# Altium schematic sheet Digit_2.SchDoc
size A3; DocumentNumber: 2; SheetNumber: 2; SheetTotal: 7
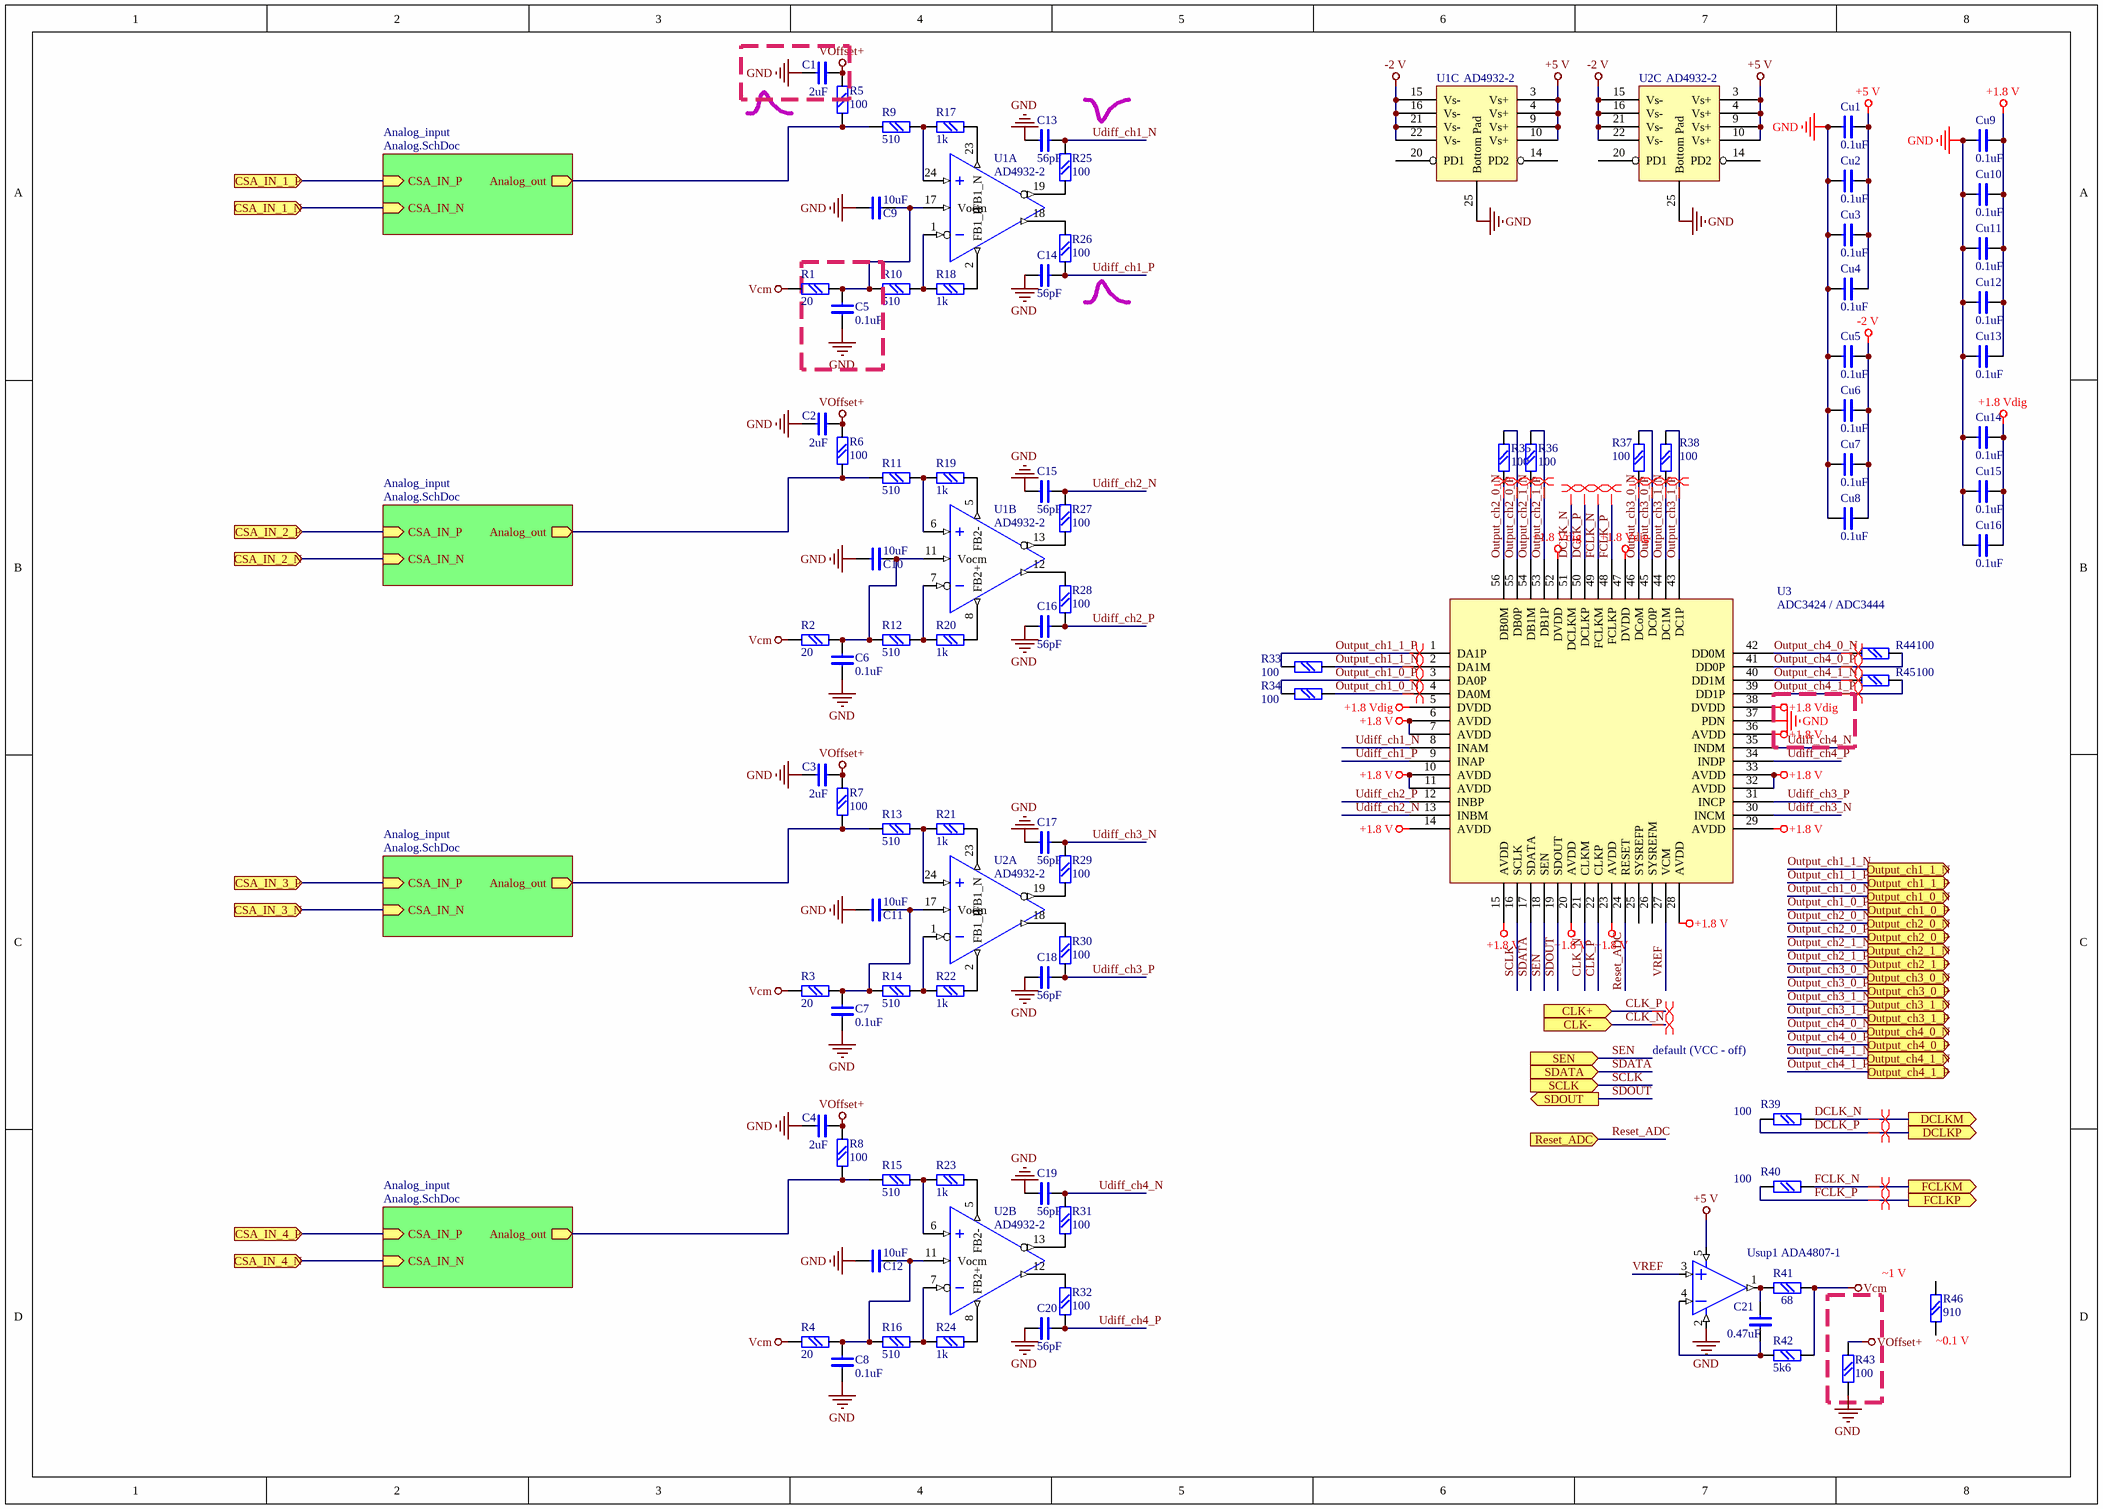
[diagram p0: Digit_2.SchDoc]

## Parts
C1  2uF  [chip0603]
C2  2uF  [chip0603]
C3  2uF  [chip0603]
C4  2uF  [chip0603]
C5  0.1uF  [chip0603]
C6  0.1uF  [chip0603]
C7  0.1uF  [chip0603]
C8  0.1uF  [chip0603]
C9  10uF  [chip0603]
C10  10uF  [chip0603]
C11  10uF  [chip0603]
C12  10uF  [chip0603]
C13  56pF  [chip0603]
C14  56pF  [chip0603]
C15  56pF  [chip0603]
C16  56pF  [chip0603]
C17  56pF  [chip0603]
C18  56pF  [chip0603]
C19  56pF  [chip0603]
C20  56pF  [chip0603]
C21  0.47uF  [chip0603]
Cu1  0.1uF  [chip0603]
Cu2  0.1uF  [chip0603]
Cu3  0.1uF  [chip0603]
Cu4  0.1uF  [chip0603]
Cu5  0.1uF  [chip0603]
Cu6  0.1uF  [chip0603]
Cu7  0.1uF  [chip0603]
Cu8  0.1uF  [chip0603]
Cu9  0.1uF  [chip0603]
Cu10  0.1uF  [chip0603]
Cu11  0.1uF  [chip0603]
Cu12  0.1uF  [chip0603]
Cu13  0.1uF  [chip0603]
Cu14  0.1uF  [chip0603]
Cu15  0.1uF  [chip0603]
Cu16  0.1uF  [chip0603]
R1  20  [chip0603]
R2  20  [chip0603]
R3  20  [chip0603]
R4  20  [chip0603]
R5  100  [chip0603]
R6  100  [chip0603]
R7  100  [chip0603]
R8  100  [chip0603]
R9  510  [chip0603]
R10  510  [chip0603]
R11  510  [chip0603]
R12  510  [chip0603]
R13  510  [chip0603]
R14  510  [chip0603]
R15  510  [chip0603]
R16  510  [chip0603]
R17  1k  [chip0603]
R18  1k  [chip0603]
R19  1k  [chip0603]
R20  1k  [chip0603]
R21  1k  [chip0603]
R22  1k  [chip0603]
R23  1k  [chip0603]
R24  1k  [chip0603]
R25  100  [chip0603]
R26  100  [chip0603]
R27  100  [chip0603]
R28  100  [chip0603]
R29  100  [chip0603]
R30  100  [chip0603]
R31  100  [chip0603]
R32  100  [chip0603]
R33  100  [0402]
R34  100  [0402]
R35  100  [0402]
R36  100  [0402]
R37  100  [0402]
R38  100  [0402]
R39  100  [0402]
R40  100  [0402]
R41  68  [chip0603]
R42  5k6  [chip0603]
R43  100  [chip0603]
R44  100  [0402]
R45  100  [0402]
R46  910  [chip0603]
U1  AD4932-2  [CP-24-13]  (parts A,B,C of 3)
U2  AD4932-2  [CP-24-13]  (parts A,B,C of 3)
U3  ADC3424 / ADC3444  [PQFN-56]
Usup1  ADA4807-1  [SOT23-5]

## Blocks framed on the sheet
~1 V: R43

## Sub-sheets
Analog_input = Analog.SchDoc: CSA_IN_P (in), CSA_IN_N (in), Analog_out (out)
Analog_input = Analog.SchDoc: CSA_IN_P (in), CSA_IN_N (in), Analog_out (out)
Analog_input = Analog.SchDoc: CSA_IN_P (in), CSA_IN_N (in), Analog_out (out)
Analog_input = Analog.SchDoc: CSA_IN_P (in), CSA_IN_N (in), Analog_out (out)

## Ports
CLK+ (in), CLK- (in), CSA_IN_1_N (in), CSA_IN_1_P (in), CSA_IN_2_N (in), CSA_IN_2_P (in), CSA_IN_3_N (in), CSA_IN_3_P (in), CSA_IN_4_N (in), CSA_IN_4_P (in), DCLKM (out), DCLKP (out), FCLKM (out), FCLKP (out), Output_ch1_0_N (out), Output_ch1_0_P (out), Output_ch1_1_N (out), Output_ch1_1_P (out), Output_ch2_0_N (out), Output_ch2_0_P (out), Output_ch2_1_N (out), Output_ch2_1_P (out), Output_ch3_0_N (out), Output_ch3_0_P (out), Output_ch3_1_N (out), Output_ch3_1_P (out), Output_ch4_0_N (out), Output_ch4_0_P (out), Output_ch4_1_N (out), Output_ch4_1_P (out), Reset_ADC (in), SCLK (in), SDATA (in), SDOUT (out), SEN (in)

## Nets
+1.8 V: Cu9.2 Cu10.2 Cu11.2 Cu12.2 Cu13.2 U3.6(AVDD) U3.7(AVDD) U3.10(AVDD) U3.11(AVDD) U3.14(AVDD) U3.15(AVDD) U3.20(AVDD) U3.23(AVDD) U3.28(AVDD) U3.29(AVDD) U3.32(AVDD) U3.33(AVDD) U3.36(AVDD)
+1.8 Vdig: Cu14.2 Cu15.2 Cu16.2 U3.5(DVDD) U3.38(DVDD) U3.47(DVDD) U3.52(DVDD)
+5 V: Cu1.2 Cu2.2 Cu3.2 Cu4.2 U1.3(Vs+) U1.4(Vs+) U1.9(Vs+) U1.10(Vs+) U2.3(Vs+) U2.4(Vs+) U2.9(Vs+) U2.10(Vs+) Usup1.5(E+)
-2 V: Cu5.2 Cu6.2 Cu7.2 Cu8.2 U1.15(Vs-) U1.16(Vs-) U1.21(Vs-) U1.22(Vs-) U2.15(Vs-) U2.16(Vs-) U2.21(Vs-) U2.22(Vs-)
GND: C1.1 C2.1 C3.1 C4.1 C5.1 C6.1 C7.1 C8.1 C9.1 C10.1 C11.1 C12.1 C13.2 C14.1 C15.2 C16.1 C17.2 C18.1 C19.2 C20.1 Cu1.1 Cu2.1 Cu3.1 Cu4.1 Cu5.1 Cu6.1 Cu7.1 Cu8.1 Cu9.1 Cu10.1 Cu11.1 Cu12.1 Cu13.1 Cu14.1 Cu15.1 Cu16.1 R43.2 U1.25(Bottom_Pad) U2.25(Bottom_Pad) U3.37(PDN) Usup1.2(E-)
Vcm: R1.2 R2.2 R3.2 R4.2 R41.2 R42.2
VOffset+: C1.2 C2.2 C3.2 C4.2 R5.2 R6.2 R7.2 R8.2 R43.1
CLK_N: U3.21(CLKM) ; port CLK-
CLK_P: U3.22(CLKP) ; port CLK+
CSA_IN_1_N: port CSA_IN_1_N, sheet Analog_input/CSA_IN_N
CSA_IN_1_P: port CSA_IN_1_P, sheet Analog_input/CSA_IN_P
CSA_IN_2_N: port CSA_IN_2_N, sheet Analog_input/CSA_IN_N
CSA_IN_2_P: port CSA_IN_2_P, sheet Analog_input/CSA_IN_P
CSA_IN_3_N: port CSA_IN_3_N, sheet Analog_input/CSA_IN_N
CSA_IN_3_P: port CSA_IN_3_P, sheet Analog_input/CSA_IN_P
CSA_IN_4_N: port CSA_IN_4_N, sheet Analog_input/CSA_IN_N
CSA_IN_4_P: port CSA_IN_4_P, sheet Analog_input/CSA_IN_P
DCLK_N: R39.2 U3.51(DCLKM) ; port DCLKM
DCLK_P: R39.1 U3.50(DCLKP) ; port DCLKP
FCLK_N: R40.2 U3.49(FCLKM) ; port FCLKM
FCLK_P: R40.1 U3.48(FCLKP) ; port FCLKP
Output_ch1_0_N: R34.2 U3.4(DA0M) ; port Output_ch1_0_N
Output_ch1_0_P: R34.1 U3.3(DA0P) ; port Output_ch1_0_P
Output_ch1_1_N: R33.2 U3.2(DA1M) ; port Output_ch1_1_N
Output_ch1_1_P: R33.1 U3.1(DA1P) ; port Output_ch1_1_P
Output_ch2_0_N: R35.1 U3.56(DB0M) ; port Output_ch2_0_N
Output_ch2_0_P: R35.2 U3.55(DB0P) ; port Output_ch2_0_P
Output_ch2_1_N: R36.1 U3.54(DB1M) ; port Output_ch2_1_N
Output_ch2_1_P: R36.2 U3.53(DB1P) ; port Output_ch2_1_P
Output_ch3_0_N: R37.1 U3.46(DCoM) ; port Output_ch3_0_N
Output_ch3_0_P: R37.2 U3.45(DC0P) ; port Output_ch3_0_P
Output_ch3_1_N: R38.1 U3.44(DC1M) ; port Output_ch3_1_N
Output_ch3_1_P: R38.2 U3.43(DC1P) ; port Output_ch3_1_P
Output_ch4_0_N: R44.1 U3.42(DD0M) ; port Output_ch4_0_N
Output_ch4_0_P: R44.2 U3.41(DD0P) ; port Output_ch4_0_P
Output_ch4_1_N: R45.1 U3.40(DD1M) ; port Output_ch4_1_N
Output_ch4_1_P: R45.2 U3.39(DD1P) ; port Output_ch4_1_P
Reset_ADC: U3.24(RESET) ; port Reset_ADC
SCLK: U3.16(SCLK) ; port SCLK
SDATA: U3.17(SDATA) ; port SDATA
SDOUT: U3.19(SDOUT) ; port SDOUT
SEN: U3.18(SEN) ; port SEN
Udiff_ch1_N: C13.1 R25.2 U3.8(INAM)
Udiff_ch1_P: C14.2 R26.2 U3.9(INAP)
Udiff_ch2_N: C15.1 R27.2 U3.13(INBM)
Udiff_ch2_P: C16.2 R28.2 U3.12(INBP)
Udiff_ch3_N: C17.1 R29.2 U3.30(INCM)
Udiff_ch3_P: C18.2 R30.2 U3.31(INCP)
Udiff_ch4_N: C19.1 R31.2 U3.35(INDM)
Udiff_ch4_P: C20.2 R32.2 U3.34(INDP)
VREF: U3.27(VCM) Usup1.3(+IN)
NetC5_2: C5.2 C9.2 R1.1 R10.2 U1.17(Vocm)
NetC6_2: C6.2 C10.2 R2.1 R12.2 U1.11(Vocm)
NetC7_2: C7.2 C11.2 R3.1 R14.2 U2.17(Vocm)
NetC8_2: C8.2 C12.2 R4.1 R16.2 U2.11(Vocm)
NetC21_1: C21.1 R41.1 Usup1.1(OUT)
NetC21_2: C21.2 R42.1 Usup1.4(-IN)
NetR5_1: R5.1 R9.2 ; sheet Analog_input/Analog_out
NetR6_1: R6.1 R11.2 ; sheet Analog_input/Analog_out
NetR7_1: R7.1 R13.2 ; sheet Analog_input/Analog_out
NetR8_1: R8.1 R15.2 ; sheet Analog_input/Analog_out
NetR9_1: R9.1 R17.1 U1.24(In+)
NetR10_1: R10.1 R18.2 U1.1(In-)
NetR11_1: R11.1 R19.1 U1.6(In+)
NetR12_1: R12.1 R20.2 U1.7(In-)
NetR13_1: R13.1 R21.1 U2.24(In+)
NetR14_1: R14.1 R22.2 U2.1(In-)
NetR15_1: R15.1 R23.1 U2.6(In+)
NetR16_1: R16.1 R24.2 U2.7(In-)
NetR17_2: R17.2 U1.23(FB1_N)
NetR18_1: R18.1 U1.2(FB1_P)
NetR19_2: R19.2 U1.5(FB2-)
NetR20_1: R20.1 U1.8(FB2+)
NetR21_2: R21.2 U2.23(FB1_N)
NetR22_1: R22.1 U2.2(FB1_P)
NetR23_2: R23.2 U2.5(FB2-)
NetR24_1: R24.1 U2.8(FB2+)
NetR25_1: R25.1 U1.19(Out-)
NetR26_1: R26.1 U1.18(Out+)
NetR27_1: R27.1 U1.13(Out-)
NetR28_1: R28.1 U1.12(Out+)
NetR29_1: R29.1 U2.19(Out-)
NetR30_1: R30.1 U2.18(Out+)
NetR31_1: R31.1 U2.13(Out-)
NetR32_1: R32.1 U2.12(Out+)

Not connected (* = marked no-connect by the designer): R46 1 2; U1 14(PD2) 20(PD1); U2 14(PD2) 20(PD1); U3 25(SYSREFP) 26(SYSREFM)

## Layout directives
differential pair: CLK_N, CLK_P, DCLK_N, DCLK_P, FCLK_N, FCLK_P, Output_ch1_0_N, Output_ch1_0_P, Output_ch1_1_N, Output_ch1_1_P, Output_ch2_0_N, Output_ch2_0_P, Output_ch2_1_N, Output_ch2_1_P, Output_ch3_0_N, Output_ch3_0_P, Output_ch3_1_N, Output_ch3_1_P, Output_ch4_0_N, Output_ch4_0_P, Output_ch4_1_N, Output_ch4_1_P

## Notes on the sheet
- default (VCC - off)
- (near R46) ~0.1 V

## Library data of the parts
C1-C21 Cu1-Cu16 = C: Text Field1: 20; Text Field2: 10
R1-R4 = R: Text Field1: 20; Text Field2: 20
R5-R46 = R: Text Field1: 20; Text Field2: 20
U3 = ADC3424
Usup1 = AD8005ART: Text Field1: 40; Text Field2: 40